# Altium schematic sheet encoder.SchDoc
size A4; SheetNumber: 9; SheetTotal: 11
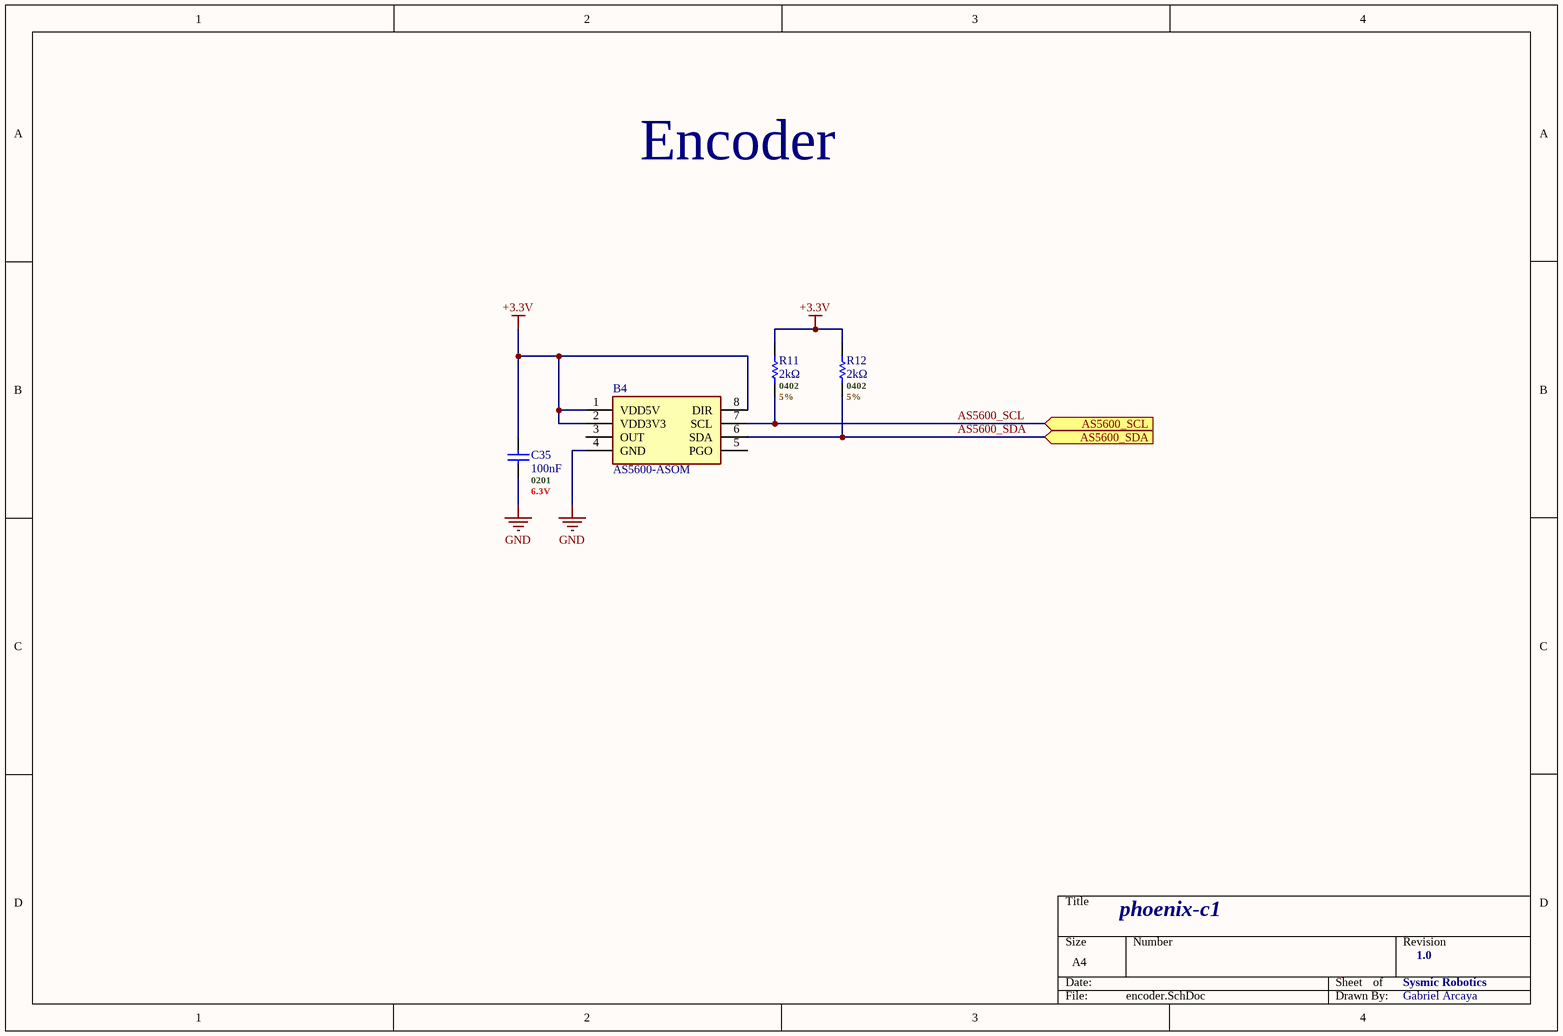
[diagram p0: encoder.SchDoc]

## Parts
B4  AS5600-ASOM  [SOIC-8 - OSRAM]
C35  100nF  .Case/Package: 0201  .Voltage Rating (DC): 6.3V  [C0201 - MURATA]
R11  2kΩ  .Case/Package: 0402  .Tolerance: 5%  [R0402 - YAGEO]
R12  2kΩ  .Case/Package: 0402  .Tolerance: 5%  [R0402 - YAGEO]

## Ports
AS5600_SCL (in, see phoenix-c1-sch[2C], stm32g4[3C]), AS5600_SDA (in, see phoenix-c1-sch[2C], stm32g4[3C])

## Nets
+3.3V: B4.1(VDD5V) B4.2(VDD3V3) B4.8(DIR) C35.2 R11.2 R12.2
GND: B4.4(GND) C35.1
AS5600_SCL: B4.7(SCL) R11.1 ; port AS5600_SCL
AS5600_SDA: B4.6(SDA) R12.1 ; port AS5600_SDA

Not connected (* = marked no-connect by the designer): B4 3(OUT) 5(PGO)

## Notes on the sheet
- Encoder
- phoenix-c1
- Sysmic Robotics
- 1.0
- Gabriel Arcaya

## Library data of the parts
B4 = AS5600-ASOM: IC SENSOR MAG ROTARY 12BIT 8SOIC; Manufacturer_Name: ams OSRAM; Geometry.Height: 1.75mm; Mouser Part Number: 985-AS5600-ASOM; Mouser Price/Stock: https://www.mouser.co.uk/ProductDetail/ams-OSRAM/AS5600-ASOM?qs=KTMMzrZdriG6aU1h9lJCUQ%3D%3D; Manufacturer_Part_Number: AS5600-ASOM; Datasheet Link: https://datasheet.datasheetarchive.com/originals/distributors/DKDS-11/214624.pdf; Supplier 1: Mouser; Supplier Part Number 1: 985-AS5600-ASOM
C35 = GRT033R60J104KE01J: Ceramic Capacitor, Multilayer, Ceramic, 6.3V, 10% +Tol, 10% -Tol, X5R, 15% TC, 0.1uF, Surface Mount, 0201; Manufacturer: Murata; Manufacturer Lifecycle Status: IN PRODUCTION; Supplier: Mouser; Supplier Part Number: 81-GRT033R60J104KE1J; Manufacturer Part Number: GRT033R60J104KE01J; RoHS: Compliant; Category: Ceramic Capacitors; Stock: 150000; Pricing: 1=0,1, 10=0,017, 50=0,017, 100=0,014, 1000=0,009, 10000=0,007 (USD); Value: 100nF; Case/Package: 0201; Dielectric Material: Ceramic; Height: 300µm; Length: 600µm; Lifecycle Status: Production; Material: Ceramic; Max Operating Temperature: 85°C; Min Operating Temperature: -55°C; Mounting Technology: Surface Mount; Number of Terminals: 2; REACH SVHC: Yes; Thickness: 300µm; Tolerance: 10%; Voltage Rating: 6.3V; Voltage Rating (DC): 6.3V; Width: 300µm; ComponentLink1URL: https://datasheet.octopart.com:443/GRT033R60J104KE01J-Murata-datasheet-141283033.pdf?src-supplier=Geoflip; ComponentLink1Description: https://datasheet.octopart.com:443/GRT033R60J104KE01J-Murata-datasheet-141283033.pdf?src-supplier=Geoflip; ComponentLink2URL: https://datasheet.octopart.com:443/GRT033R60J104KE01J-Murata-datasheet-140710645.pdf?src-supplier=Ciiva; ComponentLink2Description: https://datasheet.octopart.com:443/GRT033R60J104KE01J-Murata-datasheet-140710645.pdf?src-supplier=Ciiva; ComponentLink3URL: https://datasheet.octopart.com:443/GRT033R60J104KE01J-Murata-datasheet-138748272.pdf?src-supplier=Ciiva; ComponentLink3Description: https://datasheet.octopart.com:443/GRT033R60J104KE01J-Murata-datasheet-138748272.pdf?src-supplier=Ciiva; ComponentLink4URL: http://sigma.octopart.com:80/reach_statement/Murata-company-16.pdf?src-supplier=Compliance+Statements; ComponentLink4Description: http://sigma.octopart.com:80/reach_statement/Murata-company-16.pdf?src-supplier=Compliance+Statements; Supplier 1: Mouser; Supplier Part Number 1: 81-GRT033R60J104KE1J
R11 R12 = AF0402JR-072KL: Anti-Sulfurated Chip Resistor Thick Film 0402 2kOhm 5% Paper T/R; Manufacturer: Yageo Group; Max Power Dissipation: 63mW; Power Dissipation: 62.5mW; Temperature Coefficient: 100ppm/°C; Voltage Rating: 50V; Supplier: Mouser; Supplier Part Number: 603-AF0402JR-072KL; Manufacturer Part Number: AF0402JR-072KL; RoHS: Compliant; Category: Chip SMD Resistors; Stock: 66785; Pricing: 1=0,1, 10=0,007, 50=0,007, 100=0,006, 1000=0,005, 10000=0,005 (USD); Case/Package: 0402; China RoHS: Non-Compliant; Composition: Thick Film; Features: Anti-Sulfur, Moisture Resistant; Height: 350µm; Length: 990.6µm; Lifecycle Status: Production; Max Operating Temperature: 155°C; Min Operating Temperature: -55°C; Mounting Technology: Surface Mount; Number of Terminals: 2; Number of Terminations: 2; Packaging: Tape & Reel; Power Rating: 62.5mW; REACH SVHC: Yes; Value: 2kΩ; Tolerance: 5%; Width: 500µm; Working Voltage: 50V; ComponentLink1URL: https://datasheet.octopart.com:443/AF0402JR-072KL-Yageo-datasheet-182189395.pdf?src-supplier=IHS; ComponentLink1Description: https://datasheet.octopart.com:443/AF0402JR-072KL-Yageo-datasheet-182189395.pdf?src-supplier=IHS; ComponentLink2URL: https://datasheet.octopart.com:443/AF0402JR-072KL-Yageo-datasheet-153645569.pdf?src-supplier=Upverter; ComponentLink2Description: https://datasheet.octopart.com:443/AF0402JR-072KL-Yageo-datasheet-153645569.pdf?src-supplier=Upverter; ComponentLink3URL: https://sigma.octopart.com:443/138820526/technical_drawing/Yageo-AF0402JR-072KL.pdf?src-supplier=Upverter; ComponentLink3Description: https://sigma.octopart.com:443/138820526/technical_drawing/Yageo-AF0402JR-072KL.pdf?src-supplier=Upverter; ComponentLink4URL: https://datasheet.octopart.com/AF0402JR-072KL-Yageo-datasheet-68296209.pdf; ComponentLink4Description: https://datasheet.octopart.com/AF0402JR-072KL-Yageo-datasheet-68296209.pdf; ComponentLink5URL: https://datasheet.octopart.com:443/AF0402JR-072KL-Yageo-datasheet-164730775.pdf?src-supplier=Future+Electronics; ComponentLink5Description: https://datasheet.octopart.com:443/AF0402JR-072KL-Yageo-datasheet-164730775.pdf?src-supplier=Future+Electronics; ComponentLink6URL: https://datasheet.octopart.com:443/AF0402JR-072KL-Yageo-datasheet-137481464.pdf?src-supplier=Future+Electronics; ComponentLink6Description: https://datasheet.octopart.com:443/AF0402JR-072KL-Yageo-datasheet-137481464.pdf?src-supplier=Future+Electronics; ComponentLink7URL: https://datasheet.octopart.com:443/AF0402JR-072KL-Yageo-datasheet-27714391.pdf?src-supplier=Future+Electronics; ComponentLink7Description: https://datasheet.octopart.com:443/AF0402JR-072KL-Yageo-datasheet-27714391.pdf?src-supplier=Future+Electronics; ComponentLink8URL: http://sigma.octopart.com:80/rohs_statement/Yageo-company-2.pdf?src-supplier=Compliance+Statements; ComponentLink8Description: http://sigma.octopart.com:80/rohs_statement/Yageo-company-2.pdf?src-supplier=Compliance+Statements; ComponentLink9URL: http://sigma.octopart.com:80/conflict_mineral_statement/Yageo-company-3.pdf?src-supplier=Compliance+Statements; ComponentLink9Description: http://sigma.octopart.com:80/conflict_mineral_statement/Yageo-company-3.pdf?src-supplier=Compliance+Statements; Supplier 1: Mouser; Supplier Part Number 1: 603-AF0402JR-072KL